# Altium schematic sheet IO_function.SchDoc
size A0; Organization: Altium Limited; Address1: L3, 12a Rodborough Rd; Address2: Frenchs Forest; Address3: NSW; Address4: Australia 2086
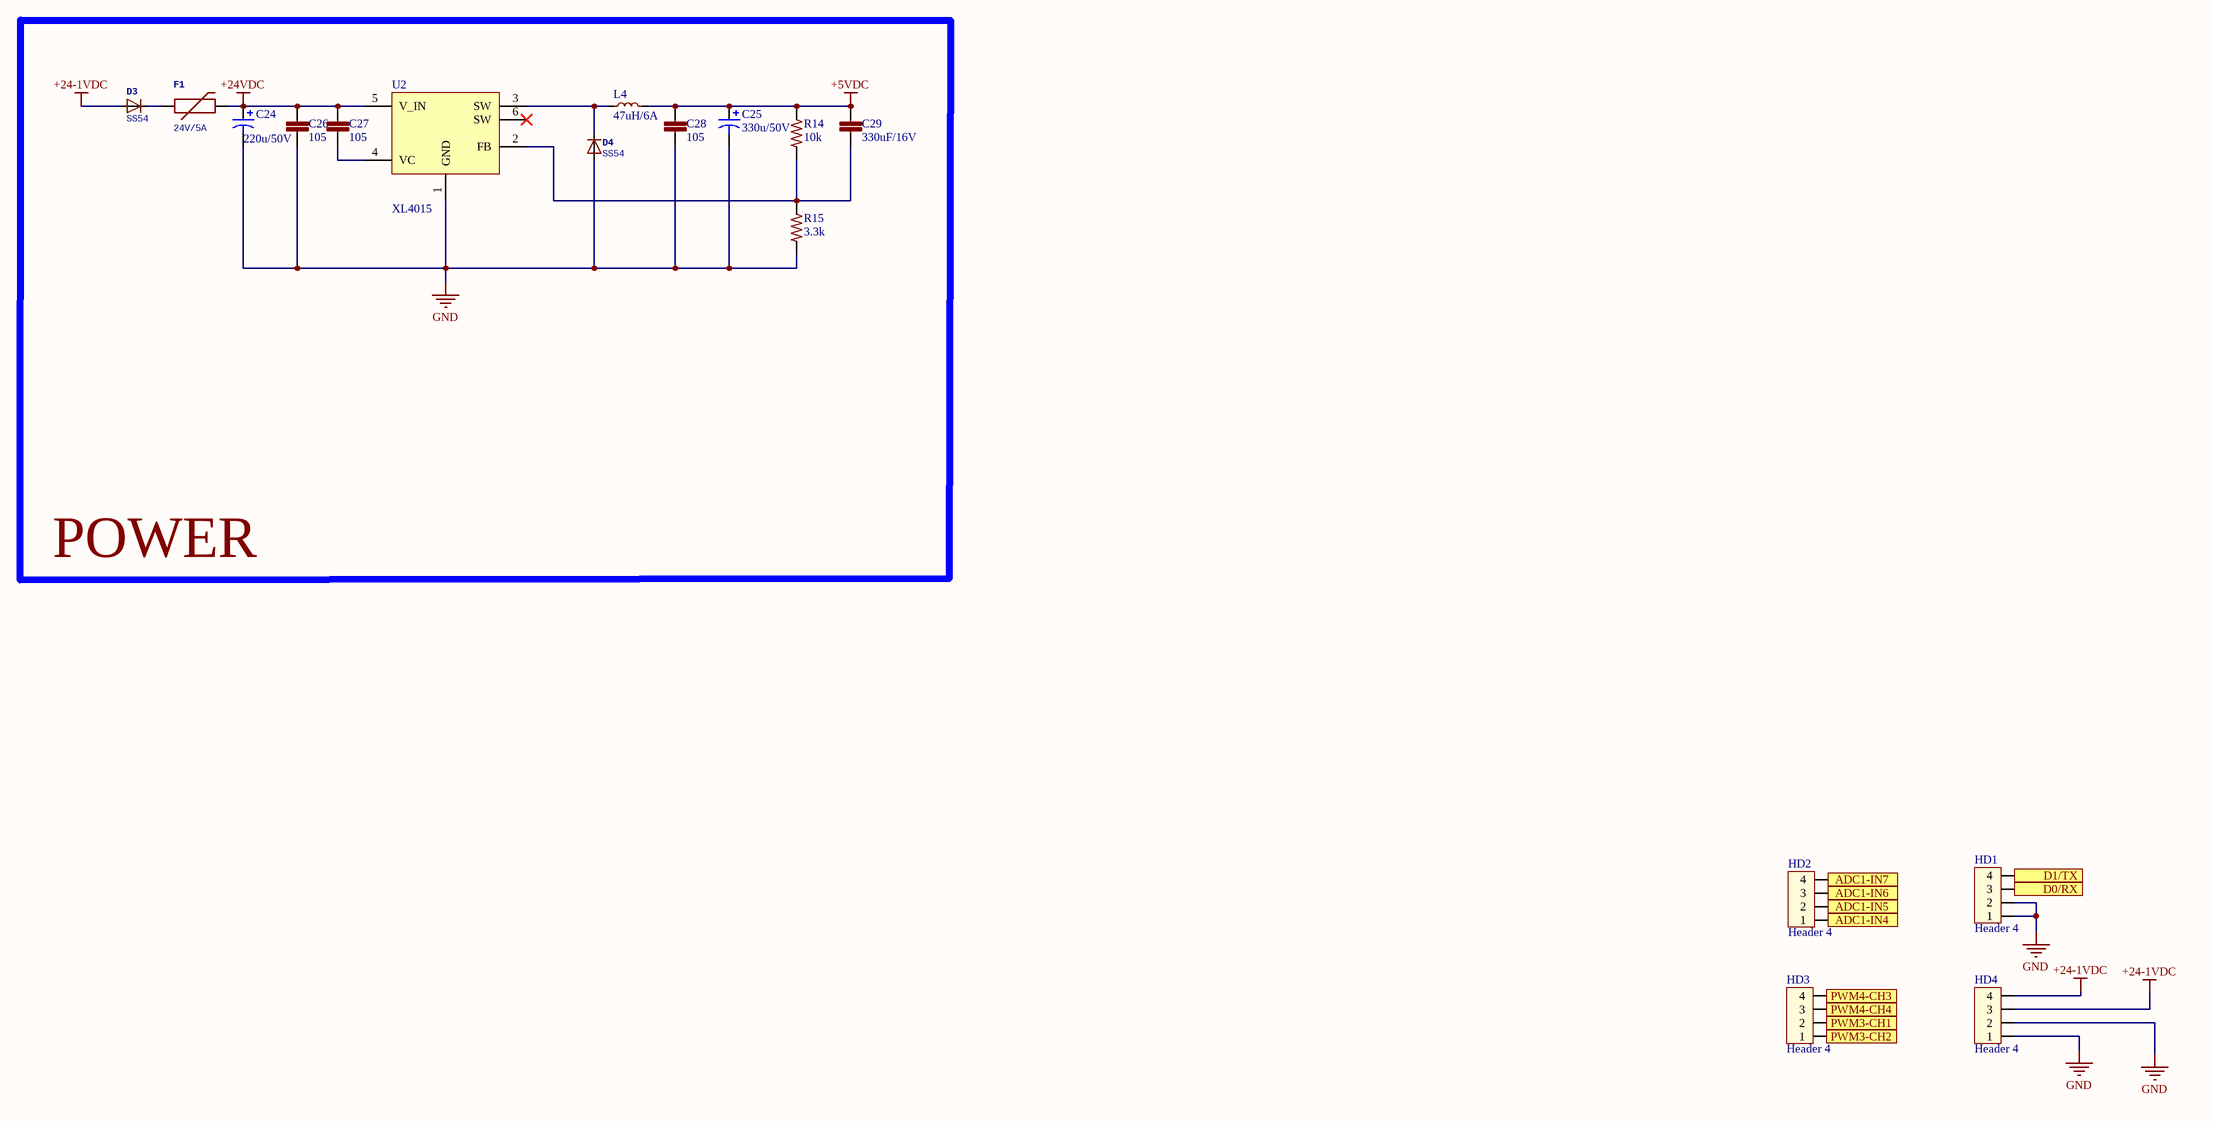
[diagram p0: IO_function.SchDoc]

## Parts
C24  220u/50V  [CAP_SMD_8x10]
C25  330u/50V  [CAP_SMD_8x10]
C26  105  [CAP_SMD0603]
C27  105  [CAP_SMD0603]
C28  105  [CAP_SMD0603]
C29  330uF/16V  [CAP_SMD0603]
D3  SS54  [SMB]
D4  SS54  [SMB]
F1  24V/5A  [1206]
HD1  Header 4  [HED4]
HD2  Header 4  [HED4]
HD3  Header 4  [HED4]
HD4  Header 4  [HED4]
L4  47uH/6A  [Inductor_47uH_6A]
R14  10k  [RES_SMD0603]
R15  3.3k  [RES_SMD0603]
U2  XL4015  [TO-263-5]

## Ports
ADC1-IN4 (in), ADC1-IN5 (in), ADC1-IN6 (in), ADC1-IN7 (in), D0/RX (in), D1/TX (in), PWM3-CH1 (in), PWM3-CH2 (in), PWM4-CH3 (in), PWM4-CH4 (in)

## Nets
+5VDC: C25.1 C28.1 C29.1 L4.2 R14.1
+24-1VDC: D3.1 HD4.3 HD4.4
+24VDC: C24.1 C26.1 C27.1 F1.2 U2.5(V_IN)
GND: C24.2 C25.2 C26.2 C28.2 D4.1 HD1.1 HD1.2 HD4.1 HD4.2 R15.2 U2.1(GND)
ADC1-IN4: HD2.1 ; port ADC1-IN4
ADC1-IN5: HD2.2 ; port ADC1-IN5
ADC1-IN6: HD2.3 ; port ADC1-IN6
ADC1-IN7: HD2.4 ; port ADC1-IN7
D0/RX: HD1.3 ; port D0/RX
D1/TX: HD1.4 ; port D1/TX
PWM3-CH1: HD3.2 ; port PWM3-CH1
PWM3-CH2: HD3.1 ; port PWM3-CH2
PWM4-CH3: HD3.4 ; port PWM4-CH3
PWM4-CH4: HD3.3 ; port PWM4-CH4
NetC27_2: C27.2 U2.4(VC)
NetC29_2: C29.2 R14.2 R15.1 U2.2(FB)
NetD3_2: D3.2 F1.1
NetD4_2: D4.2 L4.1 U2.3(SW)

Not connected (* = marked no-connect by the designer): U2 6(SW)*

## Notes on the sheet
- Labels drawn without touching a wire or pin: POWER
- Title
- Size:
- Date:
- File:
- A0
- Number:
- Time:
- Revision:
- Sheet
- of

## Library data of the parts
C24 C25 = Cap_Pol
C26-C29 = Cap
D3 D4 = DIODE
F1 = Fuse
HD1-HD4 = Hed4: Header 4 (Green); Value: Header 4
L4 = Inductors
R14 R15 = Resistor